# EAGLE design usbboard (EAGLE 7.6.0)
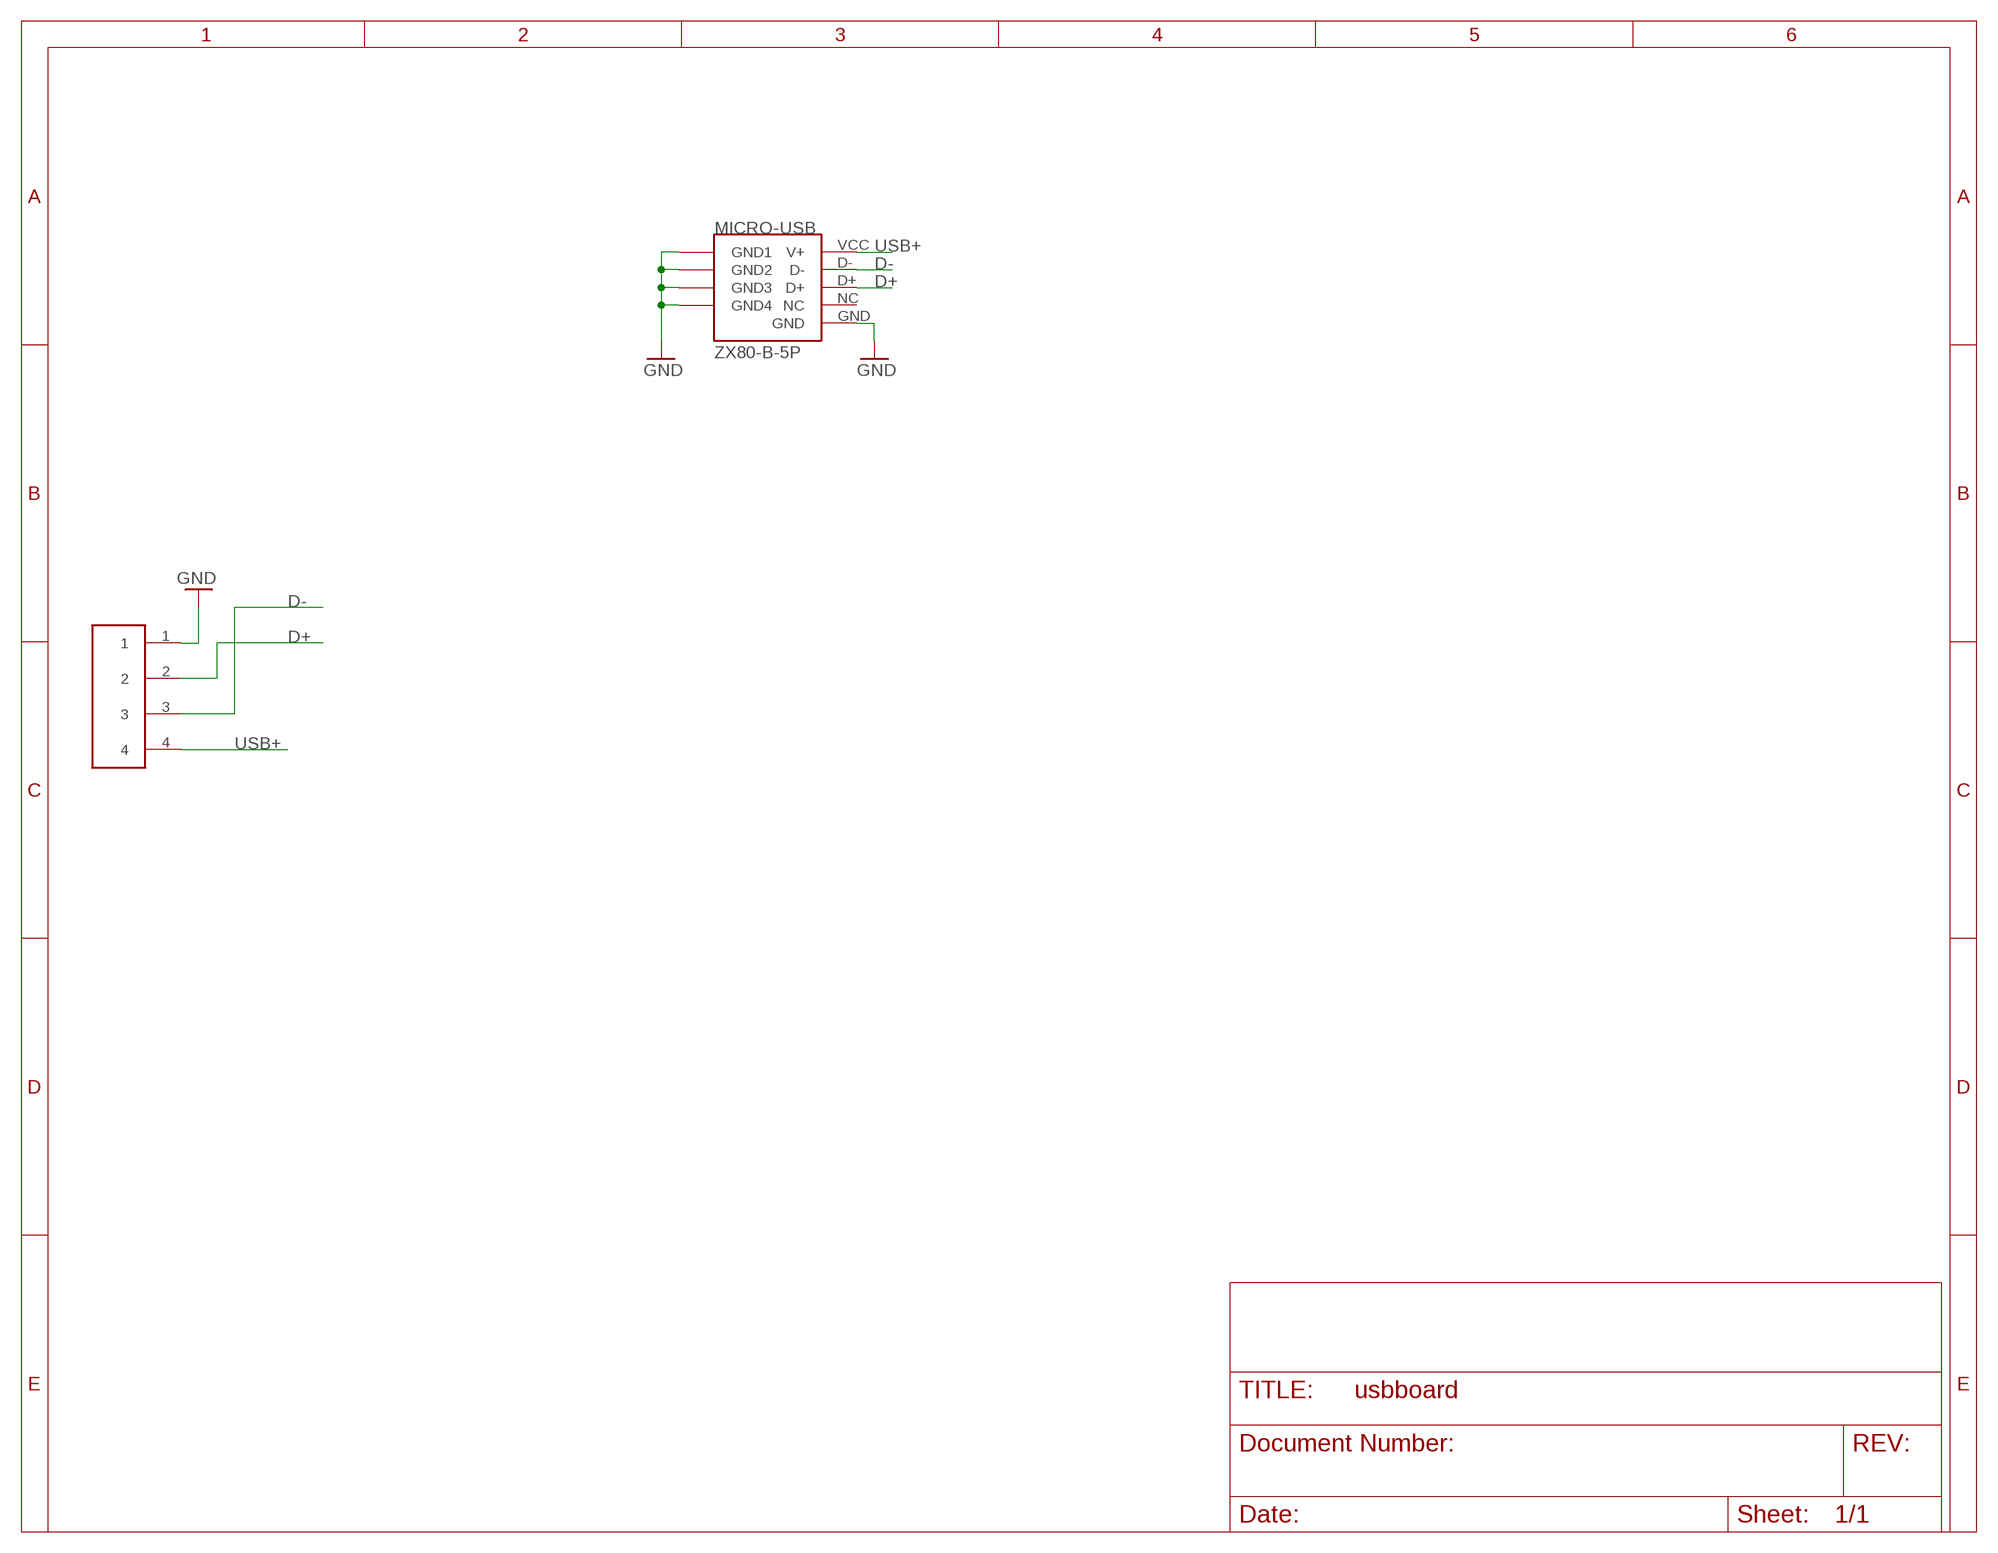
[diagram p0: schematic, sheet 1]

## Parts
MICRO-USB  ZX80-B-5P  USB_VERT  [USB_VERT]
U$3  4PIN_HEADER  [4PIN_HEADER]

## Nets
D+: MICRO-USB.D+ U$3.2
D-: MICRO-USB.D- U$3.3
GND: MICRO-USB.GND MICRO-USB.GND1 MICRO-USB.GND2 MICRO-USB.GND3 MICRO-USB.GND4 U$3.1
USB+: MICRO-USB.VCC(V+) U$3.4
Unconnected: MICRO-USB.NC

## Library data of the parts
MICRO-USB = CUSTOM:USB_VERT
U$3 = CUSTOM:4PIN_HEADER

## Board
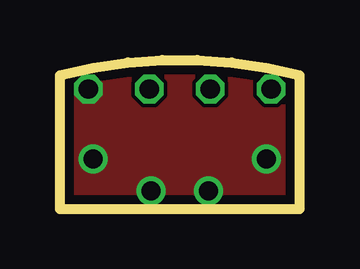
[diagram p1: board, top side]
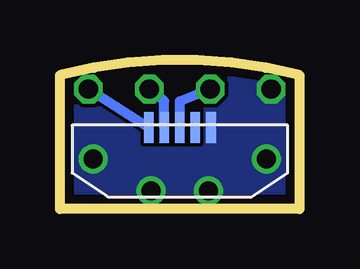
[diagram p2: board, bottom side, seen from below]

Size 10 x 6.22 mm. Coordinates in mm from the lower left corner, seen from the top.
Outline: 0,0 10,0 10,5.58 arc30 0,5.58 0,0
Copper layers (1*16): Top 0.0356mm / dielectric 1.5011mm / Bottom 0.0356mm
Design rules "LaenPCBOrder": minimum track width 6mil, minimum drill 13mil, track to track 6mil, track to pad 6mil, pad to pad 6mil, via to via 6mil, smd to smd 6mil, copper to edge 15mil, drill to drill 6mil, minimum pad ring 7mil, minimum via ring 7mil, stop-mask expansion 3mil, vias tented up to drill 0mil, thermal gap 10mil

### Footprints (pad centres in the part's own frame; a part is rotated, then mirrored left to right if it is on the bottom)
USB_VERT = smd 0.4 x 1.3: D+ 0,1.4; D- -0.65,1.4; GND 1.3,1.4; NC 0.65,1.4; VCC -1.3,1.4 | drill 0.8: GND1 -3.61,0.09; GND2 -1.2,-1.25; GND3 1.2,-1.25; GND4 3.61,0.09
4PIN_HEADER = drill 0.8 octagon: 1 -3.81,0; 2 -1.27,0; 3 1.27,0; 4 3.81,0

### Placement (x,y rotation side)
MICRO-USB  5,2 0 bottom
U$3  5,5 180 bottom

### Tracks (layer width: path | path; a pad name or v marks a point on that pad's centre or on a via)
D+
  Bottom 0.406: MICRO-USB.D+ 5,4.5 U$3.2
D-
  Bottom 0.406: MICRO-USB.D- 5.65,4.5 U$3.3
GND
  pour Top (no thermals): 0,5.58 0,0 10,0 10,5.58 arc30
  pour Bottom (no thermals): 0,0 0,5.58 arc-30 10,5.58 10,0
USB+
  Bottom 0.406: MICRO-USB.VCC U$3.4